# Altium schematic sheet Power.SchDoc
size A3; DocumentNumber: 3; SheetNumber: 4; SheetTotal: 11
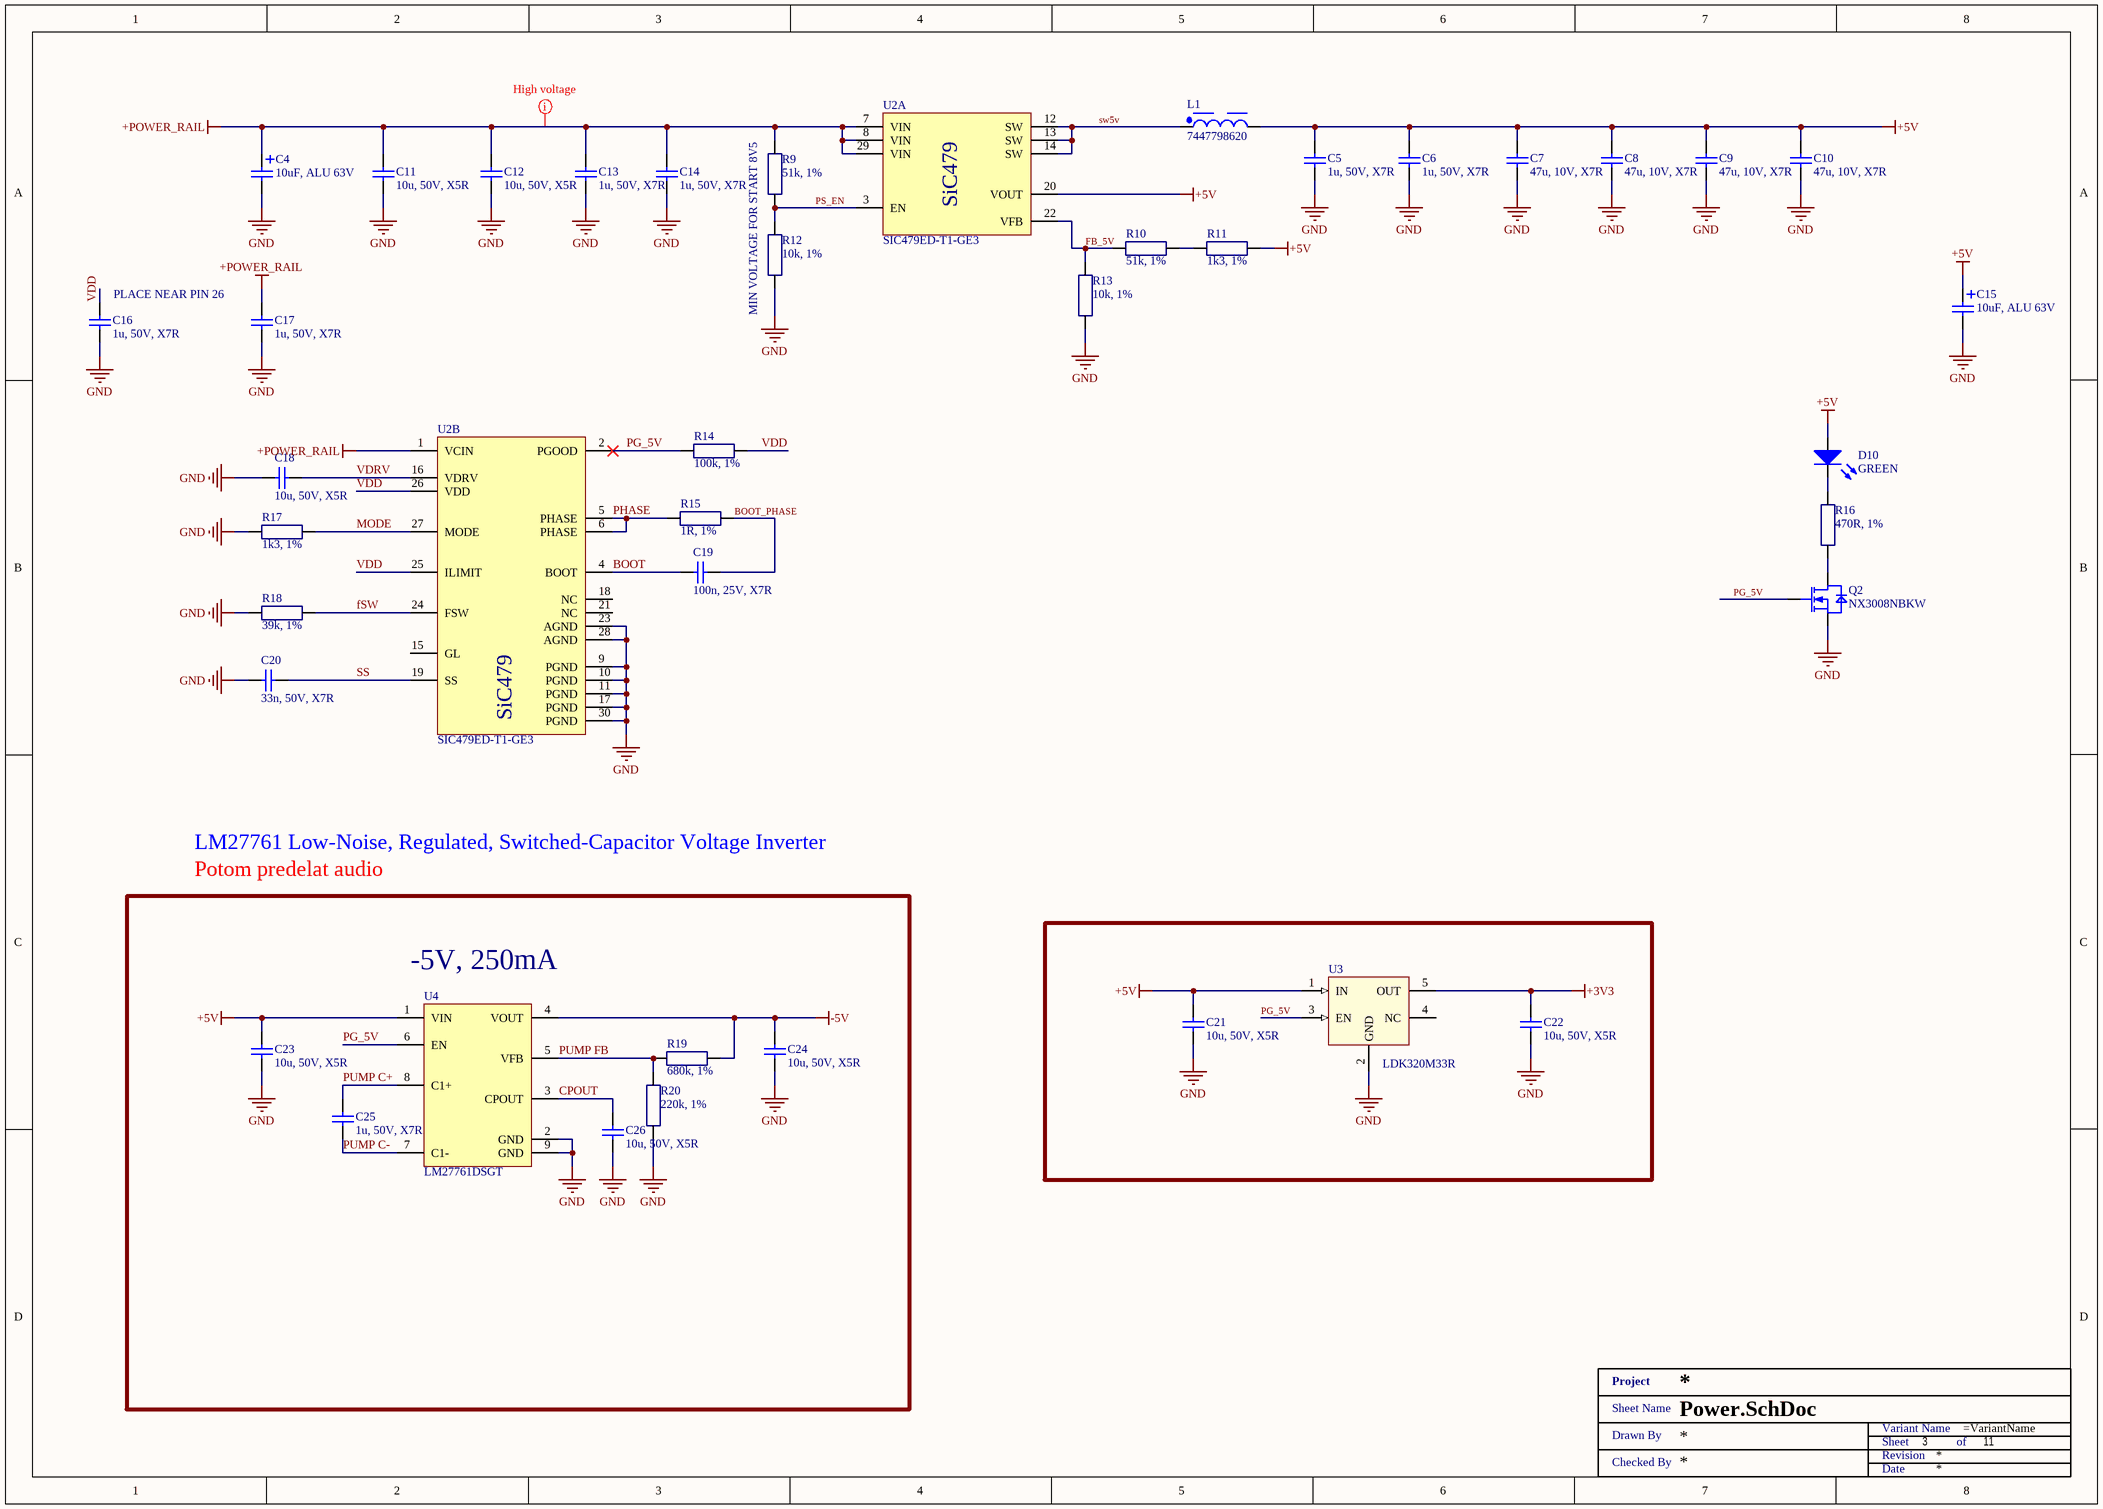
[diagram p0: Power.SchDoc]

## Parts
C4  10uF, ALU 63V  [WCAP-ATLI_5x11x2]
C5  1u, 50V, X7R  [SMD0603]
C6  1u, 50V, X7R  [SMD0603]
C7  47u, 10V, X7R  [SMD1210]
C8  47u, 10V, X7R  [SMD1210]
C9  47u, 10V, X7R  [SMD1210]
C10  47u, 10V, X7R  [SMD1210]
C11  10u, 50V, X5R  [SMD1206]
C12  10u, 50V, X5R  [SMD1206]
C13  1u, 50V, X7R  [SMD0603]
C14  1u, 50V, X7R  [SMD0603]
C15  10uF, ALU 63V  [WCAP-ATLI_5x11x2]
C16  1u, 50V, X7R  [SMD0603]
C17  1u, 50V, X7R  [SMD0603]
C18  10u, 50V, X5R  [SMD1206]
C19  100n, 25V, X7R  [SMD0603]
C20  33n, 50V, X7R  [SMD0603]
C21  10u, 50V, X5R  [SMD1206]
C22  10u, 50V, X5R  [SMD1206]
C23  10u, 50V, X5R  [SMD1206]
C24  10u, 50V, X5R  [SMD1206]
C25  1u, 50V, X7R  [SMD0603]
C26  10u, 50V, X5R  [SMD1206]
D10  GREEN  [MCL-S270]
L1  7447798620  [WE-PDF_1064]
Q2  NX3008NBKW  [SOT323]
R9  51k, 1%  [SMD0603 - R]
R10  51k, 1%  [SMD0603 - R]
R11  1k3, 1%  [SMD0603 - R]
R12  10k, 1%  [SMD0603 - R]
R13  10k, 1%  [SMD0603 - R]
R14  100k, 1%  [SMD0603 - R]
R15  1R, 1%  [SMD0603 - R]
R16  470R, 1%  [SMD0603 - R]
R17  1k3, 1%  [SMD0603 - R]
R18  39k, 1%  [SMD0603 - R]
R19  680k, 1%  [SMD0603 - R]
R20  220k, 1%  [SMD0603 - R]
U2  SIC479ED-T1-GE3  [POWERPAK_MLP55-27L_VIS]  (parts A,B of 2)
U3  LDK320M33R  [SOT23-5]
U4  LM27761DSGT  [DFN08 - 2x2mm - os]
XX?  Title 1  (value not drawn)  (graphical)

## Blocks framed on the sheet
-5V, 250mA: C23-C26 R19 R20 U4

## Nets
+3V3: C22.2 U3.5(OUT)
+5V: C5.2 C6.2 C7.2 C8.2 C9.2 C10.2 C15.1 C21.2 C23.2 D10.1(A) L1.2 R11.2 U2.20(VOUT) U3.1(IN) U4.1(VIN)
+POWER_RAIL: C4.1 C11.2 C12.2 C13.2 C14.2 C17.2 R9.2 U2.1(VCIN) U2.7(VIN) U2.8(VIN) U2.29(VIN)
-5V: C24.2 R19.2 U4.4(VOUT)
GND: C4.2 C5.1 C6.1 C7.1 C8.1 C9.1 C10.1 C11.1 C12.1 C13.1 C14.1 C15.2 C16.1 C17.1 C18.2 C20.1 C21.1 C22.1 C23.1 C24.1 C26.1 Q2.2(S) R12.1 R13.1 R17.1 R18.1 R20.1 U2.9(PGND) U2.10(PGND) U2.11(PGND) U2.17(PGND) U2.23(AGND) U2.28(AGND) U2.30(PGND) U3.2(GND) U4.2(GND) U4.9(GND)
BOOT: C19.1 U2.4(BOOT)
BOOT_PHASE: C19.2 R15.2
CPOUT: C26.2 U4.3(CPOUT)
FB_5V: R10.1 R13.2 U2.22(VFB)
fSW: R18.2 U2.24(FSW)
MODE: R17.2 U2.27(MODE)
PG_5V: Q2.1(G) R14.1 U2.2(PGOOD) U3.3(EN) U4.6(EN)
PHASE: R15.1 U2.5(PHASE) U2.6(PHASE)
PS_EN: R9.1 R12.2 U2.3(EN)
PUMP C+: C25.2 U4.8(C1+)
PUMP C-: C25.1 U4.7(C1-)
PUMP FB: R19.1 R20.2 U4.5(VFB)
SS: C20.2 U2.19(SS)
sw5v: L1.1 U2.12(SW) U2.13(SW) U2.14(SW)
VDD: C16.2 R14.2 U2.25(ILIMIT) U2.26(VDD)
VDRV: C18.1 U2.16(VDRV)
NetD10_2: D10.2(K) R16.2
NetQ2_3: Q2.3(D) R16.1
NetR10_2: R10.2 R11.1

Not connected (* = marked no-connect by the designer): U2 15(GL) 18(NC) 21(NC); U3 4(NC)

## Layout directives
net class HV: +POWER_RAIL

## Notes on the sheet
- (near C16) PLACE NEAR PIN 26
- MIN VOLTAGE FOR START 8V5
- LM27761 Low-Noise, Regulated, Switched-Capacitor Voltage Inverter
- Potom predelat audio
- (in symbol SIC479ED-T1-GE3, part A) SiC479
- (in symbol SIC479ED-T1-GE3, part B) SiC479
- (in symbol Title 1) Project; Sheet Name; Variant Name; Drawn By; Sheet; of; Revision; Checked By; Date

## Library data of the parts
C4 C15 = 860080772001: WURTH ELEKTRONIK - 860080772001 - CAP, ALU ELEC, 10UF, 63V, RADIAL; Ripple Current: 135mA @ 100kHz; Capacitance: 10u; Manufacturer: WURTH ELEKTRONIK; Manufacturer Part Number: 860080772001; RoHS: YES; Stock 1: 553; Pricing 1: 1=0.0957, 3=0.091, 5=0.0863, 10=0.0825, 20=0.0786, 50=0.0692, 250=0.0647, 500=0.0564 (GBP); ComponentLink1URL: http://www.farnell.com/datasheets/1879798.pdf; ComponentLink1Description: http://www.farnell.com/datasheets/1879798.pdf; Voltage Rating: 63V; Stock 3: 2136; Pricing 3: 1=0.62, 50=0.335, 100=0.289, 250=0.259, 500=0.235, 1500=0.202, 7500=0.182, 15000=0.178 (GBP); ComponentLink2URL: http://www.farnell.com/datasheets/2065186.pdf; ComponentLink2Description: http://www.farnell.com/datasheets/2065186.pdf; Supplier 1: Mouser; Supplier Part Number 1: 710-860080772001; Supplier 2: Farnell; Supplier Part Number 2: 2465955; Supplier 3: Digi-Key; Supplier Part Number 3: 732-9121-1-ND
C5 C6 C13 C14 C16 C17 C25 = UMK107AB7105KA-T: 0603 1 uF 50 V ±10% Tolerance X7R SMT Multilayer Ceramic Capacitor; Manufacturer: Taiyo Yuden; Supplier 1: Mouser; Supplier Part Number 1: 963-UMK107AB7105KA-T; Manufacturer Part Number: UMK107AB7105KA-T; RoHS: Yes; Category: Ceramic Capacitors; Stock 1: 419967; Pricing 1: 1=0,39000, 10=0,13500, 100=0,09200, 500=0,07800, 1000=0,06100, 4000=0,06100 (USD); Mount: Surface Mount; Case/Package: 0603; Case Code (Metric): 1608; Case Code (Imperial): 0603; Min Operating Temperature: -55°C; Max Operating Temperature: 125°C; Tolerance: 10%; Capacitance: 1u; Packaging: Tape and Reel; Package Quantity: 1; Voltage Rating: 50V; Voltage Rating (DC): 50V; Dielectric: X7R; Termination: SMD/SMT; Length: 1.6mm; Height: 0.8mm; Width: 0.031inch; Thickness: 0.037inch; Depth: 0.8mm; Radiation Hardening: No; Halogen Free: Halogen Free; ComponentLink1URL: https://datasheet.ciiva.com/15922/umk107ab7105ka-t-pdf-15922601.pdf?src-supplier=Onlinecomponents.com; ComponentLink1Description: https://datasheet.ciiva.com/15922/umk107ab7105ka-t-pdf-15922601.pdf?src-supplier=Onlinecomponents.com; ComponentLink2URL: https://datasheet.ciiva.com/6257/umk107ab7105ka-t-ss-6257600.pdf?src-supplier=Digi-Key; ComponentLink2Description: https://datasheet.ciiva.com/6257/umk107ab7105ka-t-ss-6257600.pdf?src-supplier=Digi-Key; ComponentLink3URL: https://datasheet.ciiva.com/30137/76umk107ab7105ka-t-30137806.pdf?src-supplier=Onlinecomponents.com; ComponentLink3Description: https://datasheet.ciiva.com/30137/76umk107ab7105ka-t-30137806.pdf?src-supplier=Onlinecomponents.com; Supplier 2: Farnell; Supplier Part Number 2: 2779113; Supplier 3: Digi-Key; Supplier Part Number 3: 587-3247-6-ND
C7-C10 = CL32B476MPJNNNE: Cap Ceramic 47uF 10V X7R 20% Pad SMD 1210 125C T/R; Manufacturer: Samsung; Supplier 1: Mouser; Supplier Part Number 1: 187-CL32B476MPJNNNE; Manufacturer Part Number: CL32B476MPJNNNE; RoHS: Yes; Category: Ceramic Capacitors; Stock 1: 61232; Pricing 1: 1=0.51, 10=0.377, 50=0.377, 100=0.263, 1000=0.198, 10000=0.163 (USD); Case/Package: 1210; Dielectric: X7R; Voltage Rating (DC): 10V; Tolerance: 20%; Value: 47uF; RoHS Compliant: Yes; ComponentLink1URL: http://www.samsungsem.com/kr/support/library/product-catalog/__icsFiles/afieldfile/2014/11/13/MLCC.pdf?src-supplier=Avnet; ComponentLink1Description: http://www.samsungsem.com/kr/support/library/product-catalog/__icsFiles/afieldfile/2014/11/13/MLCC.pdf?src-supplier=Avnet; Supplier 2: Arrow Electronics; Supplier Part Number 2: CL32B476MPJNNNE
C11 C12 C18 C21-C24 C26 = UMK316BBJ106KL-T: CAP CER 10UF 50V X5R 1206; Manufacturer: Taiyo Yuden; Tolerance: 10%; Supplier 1: Mouser; Supplier Part Number 1: 963-UMK316BBJ106KL-T; Manufacturer Part Number: UMK316BBJ106KL-T; RoHS: Yes; Category: Ceramic Capacitors; Stock 1: 207945; Pricing 1: 1=0,42000, 10=0,18000, 100=0,12800, 500=0,11000, 1000=0,09700, 2000=0,08000 (USD); Mount: Surface Mount; Case/Package: 1206; Min Operating Temperature: -55°C; Max Operating Temperature: 85°C; Packaging: Tape and Reel; Capacitance: 10u; Voltage Rating: 50V; Length: 0.126inch; Width: 0.063inch; Thickness: 0.071inch; Lead Free: Lead Free; ComponentLink1URL: http://ds.yuden.co.jp/TYCOMPAS/ut/detail.do?productNo=UMK316BBJ106KL-T&fileName=UMK316BBJ106KL-T_SS&mode=specSheetDownload&src-supplier=Digi-Key; ComponentLink1Description: http://ds.yuden.co.jp/TYCOMPAS/ut/detail.do?productNo=UMK316BBJ106KL-T&fileName=UMK316BBJ106KL-T_SS&mode=specSheetDownload&src-supplier=Digi-Key; ComponentLink2URL: https://www.yuden.co.jp/productdata/catalog/mlcc01_e.pdf?src-supplier=Digi-Key; ComponentLink2Description: https://www.yuden.co.jp/productdata/catalog/mlcc01_e.pdf?src-supplier=Digi-Key; ComponentLink3URL: http://www.yuden.co.jp/productdata/catalog/en/mlcc_all_e.pdf?src-supplier=Digi-Key; ComponentLink3Description: http://www.yuden.co.jp/productdata/catalog/en/mlcc_all_e.pdf?src-supplier=Digi-Key; Supplier 2: Digi-Key; Supplier Part Number 2: 587-5960-1-ND; Supplier 3: Avnet; Supplier Part Number 3: UMK316BBJ106KL-T
C19 = 06033C104KAT2A: AVX - 06033C104KAT2A - CAP, MLCC, X7R, 0.1UF, 25V, 0603; Ceramic Capacitor Case: 0603 [1608 Metric]; Voltage Rating: 25; Capacitance Tolerance: ± 10%; Dielectric Characteristic: X7; Product Range: AVX 0603 MLCC; SVHC: No SVHC (17-Dec-2015)<!--FANDB--><div class="features-and-benefits-container"><div class="features-and-benefits-desc-container"><span class="features-and-benefits-container-desc">SMD Multilayer Ceramic Capacitor, 0603 [1608 Metric], 0.1 µF, 25 V, ± 10%, X7R, AVX 0603 MLCC</span></div><div class="features-and-benefits-description"><span class="features-benefits-value">The 06033C104KAT2A is a SMD Multilayer Ceramic Capacitor with Ni/Sn-plated termination, X7R dielectric and 0603 case. X7R formulations are called temperature stable ceramics and fall into EIA class II materials. X7R is the most popular of this intermediate dielectric constant material. This capacitance change is non-linear. Capacitance for X7R varies under the influence of electrical operating conditions such as voltage and frequency. X7; Supplier 1: Farnell; Supplier Part Number 1: 2530141; Manufacturer: AVX; Manufacturer Part Number: 06033C104KAT2A; RoHS: YES; Stock 1: 22809; Pricing 1: 10=0.012, 100=0.0096, 500=0.0069, 1000=0.006, 2000=0.0048, 4000=0.0038, 20000=0.0027, 40000=0.0026 (GBP); Capacitance: 100n; Packaging: Cut Tape; Operating Temperature Min: -55; Operating Temperature Max: 125; Automotive Qualification Standard: -; MSL: MSL 1 - Unlimited; ComponentLink1URL: http://www.farnell.com/datasheets/2237835.pdf; ComponentLink1Description: http://www.farnell.com/datasheets/2237835.pdf; Supplier 2: Digi-Key; Supplier Part Number 2: 478-3714-1-ND
C20 = 06035C333JAT2A: 0603 33nF Ceramic Multilayer Capacitor; 50 V dc; +125degC; X7R Dielectric; +/-5%; Manufacturer: Kyocera AVX; Tolerance: 5%; Dissipation Factor: 2.5%; Supplier 1: Mouser; Supplier Part Number 1: 581-06035C333J; Manufacturer Part Number: 06035C333JAT2A; Stock 1: 266948; Pricing 1: 1 = 0.13000, 10 = 0.12100, 50 = 0.12100, 100 = 0.06000, 1000 = 0.03600, 10000 = 0.02400 (USD); RoHS: Yes; Mount: Surface Mount,PCB; Case/Package: 0603; Number of Pins: 2; Case Code (Metric): 1608; Case Code (Imperial): 0603; Contact Plating: Tin,Matte; Dielectric Material: Ceramic; Min Operating Temperature: -55°C; Max Operating Temperature: 125°C; Capacitance: 33n; Dielectric: X7R; Packaging: Tape and Reel; Voltage Rating (DC): 50V; Package Quantity: 1; Voltage Rating: 50V; Termination: SMD/SMT; Voltage: 50V; Length: 1.6mm; Height: 0.9mm; Width: 0.032inch; Depth: 0.81mm; Thickness: 0.035inch; Radiation Hardening: No; REACH SVHC: No SVHC; Lead Free: Lead Free; ComponentLink1URL: https://datasheet.ciiva.com/7855/1679506-7855093.pdf?src-supplier=Element14; ComponentLink1Description: https://datasheet.ciiva.com/7855/1679506-7855093.pdf?src-supplier=Element14; ComponentLink2URL: https://datasheet.ciiva.com/28694/cx7r-28694479.pdf?src-supplier=Element14; ComponentLink2Description: https://datasheet.ciiva.com/28694/cx7r-28694479.pdf?src-supplier=Element14; ComponentLink3URL: https://datasheet.ciiva.com/152/cx7r-152032.pdf?src-supplier=Digi-Key; ComponentLink3Description: https://datasheet.ciiva.com/152/cx7r-152032.pdf?src-supplier=Digi-Key; ComponentLink4URL: https://datasheet.ciiva.com/152/cx7r-152033.pdf?src-supplier=Digi-Key; ComponentLink4Description: https://datasheet.ciiva.com/152/cx7r-152033.pdf?src-supplier=Digi-Key; ComponentLink5URL: https://datasheet.ciiva.com/1457/84526-1457941.pdf?src-supplier=Element14; ComponentLink5Description: https://datasheet.ciiva.com/1457/84526-1457941.pdf?src-supplier=Element14; ComponentLink6URL: https://datasheet.ciiva.com/1457/84526-1457942.pdf?src-supplier=Element14; ComponentLink6Description: https://datasheet.ciiva.com/1457/84526-1457942.pdf?src-supplier=Element14; ComponentLink7URL: https://datasheet.ciiva.com/17084/cx7r-17084518.pdf?src-supplier=Future+Electronics; ComponentLink7Description: https://datasheet.ciiva.com/17084/cx7r-17084518.pdf?src-supplier=Future+Electronics; ComponentLink8URL: https://datasheet.ciiva.com/2987/cx7r-2987848.pdf?src-supplier=Avnet; ComponentLink8Description: https://datasheet.ciiva.com/2987/cx7r-2987848.pdf?src-supplier=Avnet; ComponentLink9URL: https://datasheet.ciiva.com/14605/70001075-14605242.pdf?src-supplier=Allied+Electronics; ComponentLink9Description: https://datasheet.ciiva.com/14605/70001075-14605242.pdf?src-supplier=Allied+Electronics; ComponentLink10URL: https://datasheet.ciiva.com/152/cx7r-152031.pdf?src-supplier=Digi-Key; ComponentLink10Description: https://datasheet.ciiva.com/152/cx7r-152031.pdf?src-supplier=Digi-Key; Supplier 2: Farnell; Supplier Part Number 2: 2280893; Supplier 3: Digi-Key; Supplier Part Number 3: 478-3723-1-ND; Supplier 4: Arrow; Supplier Part Number 4: 06035C333JAT2A
D10 = MCL-S270GC: MULTICOMP - MCL-S270GC - LED, 0805, GREEN, 10MCD, 570NM; LED Mounting: SMD; Bulb Size: 1.25mm x 1.4; Forward Current If: 20; Forward Voltage: 2.1; Wavelength Typ: 570; Luminous Intensity: 10; Viewing Angle: 140°; Lens Shape: Rectangular; SVHC: No SVHC (17-Dec-2015); Forward Voltage VF Max: 2.6; LED / Lamp Size: 1.4mm x 1.25; LED Type: Standard; Luminous Intensity Max: 16; Luminous Intensity Min: 4.5; No. of Pins: 2; Peak Forward Current: 100; Peak Wavelength: 568; Reverse Protection Voltage: 5; Voltage Vf Min: 1.7; Voltage Vf Typ: 2.1V<!--FANDB--><div class="features-and-benefits-container"><div class="features-and-benefits-description"><span class="features-benefits-value">The MCL-S270GC is a green SMD LED made of GaP dice. This LED offers water clear rectangular lens and 260°C for 5 seconds lead soldering temperature range 1.6mm from body.</span></div><div class="features-and-benefits-list"><ul class="features-and-benefits-list-list"><li class="features-and-benefits-list-item">-40 to 85; Manufacturer: MULTICOMP; Manufacturer Part Number: MCL-S270GC; RoHS: YES; Stock 1: 80989; Pricing 1: 5=0,145, 25=0,136, 100=0,126, 250=0,0813, 500=0,0645, 2000=0,0559, 5000=0,0496, 20000=0,0434 (GBP); LED Colour: Green; Packaging: Cut Tape; Product Range: -; Automotive Qualification Standard: -; MSL: MSL 3 - 168 hours; Current Rating: 20; Dominant Wavelength: 570; Dominant Wavelength Typ: 570; Forward Current If Max: 20; Luminous Intensity Typ: 10; Operating Temperature Max: 85; Operating Temperature Min: -40; Operating Temperature Range: -40°C to +85; Storage Temperature Max: +100; Storage Temperature Min: -40; ComponentLink1URL: http://www.farnell.com/cad/53028.pdf; ComponentLink1Description: http://www.farnell.com/cad/53028.pdf; ComponentLink2URL: http://www.farnell.com/datasheets/1671537.pdf; ComponentLink2Description: http://www.farnell.com/datasheets/1671537.pdf; Supplier 1: Farnell; Supplier Part Number 1: 1581242; Supplier 2: Newark; Supplier Part Number 2: 14N9356
L1 = CMP-0227-00046-2: NexarPartId: 14415868; Tolerance: 30%; RMS Current (Irms): 9.4A; Shielding: Shielded; DC Resistance (DCR): 8.4mΩ; Self Resonant Frequency: 33MHz; Max DC Current: 7A; Test Frequency: 100kHz; Core Material: Composite, Ferrite, Metal; Inductance: 6.2µH; Saturation Current: 6.7A; Number of Pins: 2; Depth: 10.2mm; Length: 10.2mm; Termination: SMD/SMT; Ambient Temperature Range High: 110°C; Max Operating Temperature: 150°C; Mount: Surface Mount; Lead Pitch: 5.8mm; Inductance Tolerance: 30%; REACH SVHC: No SVHC; Width: 10.2mm; Min Operating Temperature: -40°C; Case/Package: 1064; Height - Seated (Max): 6.4008mm; RoHS: Compliant; Current Rating: 9.4A; Ambient Temperature Range Low: -40°C; Height: 6.1mm; Composition: Wirewound; Packaging: Tape & Reel (TR)
Q2 = NX3008NBKW: NXP - NX3008NBKW - MOSFET, N CH, 30V, 350MA, SOT323; Transistor Polarity: N Channel; Continuous Drain Current Id: 350; Drain Source Voltage Vds: 30; On Resistance Rds(on): 1; Rds(on) Test Voltage Vgs: 4.5; Threshold Voltage Vgs: 900; Power Dissipation Pd: 260; Transistor Case Style: SOT-323; No. of Pins: 3; SVHC: No SVHC (17-Dec-2015); Pulse Current Idm: -0.8; Voltage Vgs th Max: 8; Manufacturer: NXP; Manufacturer Part Number: NX3008NBKW; RoHS: YES; Stock 1: 4764; Pricing 1: 1=0.0425, 25=0.0385, 100=0.0347, 250=0.0334, 500=0.0312, 2000=0.0291, 4000=0.0282, 20000=0.0273 (GBP); Operating Temperature Max: 150; Product Range: -; Automotive Qualification Standard: -; MSL: MSL 1 - Unlimited; Operating Temperature Min: -55; Operating Temperature Range: -55°C to +150; ComponentLink1URL: http://www.farnell.com/datasheets/1508392.pdf; ComponentLink1Description: http://www.farnell.com/datasheets/1508392.pdf; Supplier 1: Mouser; Supplier Part Number 1: 771-NX3008NBKW,115; Supplier 2: Farnell; Supplier Part Number 2: 2069546; Supplier 3: Arrow; Supplier Part Number 3: NX3008NBKW,115
R9 R10 = RC0603FR-0751KL: RES SMD 51K OHM 1% 1/10W 0603; Manufacturer: Yageo; Power Rating: 100mW; Voltage Rating: 50V; Temperature Coefficient: 100ppm/°C; Supplier 1: Mouser; Supplier Part Number 1: 603-RC0603FR-0751KL; Manufacturer Part Number: RC0603FR-0751KL; RoHS: Yes; Category: Chip SMD Resistors; Stock 1: 522902; Pricing 1: 1=0,10000, 10=0,01800, 50=0,01800, 100=0,00600, 1000=0,00500, 10000=0,00300 (USD); Case/Package: 0603; Number of Pins: 2; Case Code (Imperial): 0603; Case Code (Metric): 1608; Size Code: 0603; Min Operating Temperature: -55°C; Max Operating Temperature: 155°C; Tolerance: 1%; Resistance: 51k; Packaging: Tape and Reel; Package Quantity: 1; Termination: SMD/SMT; Resistor Type: Thick Film; Number of Terminations: 2; Max Power Dissipation: 100mW; Voltage Rating (DC): 50V; Features: Moisture Resistant; Series: RC; Resistance Tolerance: 1%; Technology: THICK FILM; Length: 1.6mm; Width: 0.8mm; Height: 0.45mm; Depth: 0.8mm; REACH SVHC: No SVHC; Lead Free: Lead Free; RoHS Compliant: Yes; ComponentLink1URL: https://datasheet.ciiva.com/11819/0900766b80f96399-11819378.pdf?src-supplier=RSComponents; ComponentLink1Description: https://datasheet.ciiva.com/11819/0900766b80f96399-11819378.pdf?src-supplier=RSComponents; ComponentLink2URL: https://datasheet.ciiva.com/46395/443971-46395014.pdf?src-supplier=Element14; ComponentLink2Description: https://datasheet.ciiva.com/46395/443971-46395014.pdf?src-supplier=Element14; ComponentLink3URL: https://datasheet.ciiva.com/12558/rc0603-272842-12558554.pdf?src-supplier=Mouser; ComponentLink3Description: https://datasheet.ciiva.com/12558/rc0603-272842-12558554.pdf?src-supplier=Mouser; ComponentLink4URL: https://datasheet.ciiva.com/2454/pyu-r-int-thick-7-2454123.pdf?src-supplier=Digi-Key; ComponentLink4Description: https://datasheet.ciiva.com/2454/pyu-r-int-thick-7-2454123.pdf?src-supplier=Digi-Key; ComponentLink5URL: https://datasheet.ciiva.com/2454/pyu-r-int-thick-7-2454124.pdf?src-supplier=Digi-Key; ComponentLink5Description: https://datasheet.ciiva.com/2454/pyu-r-int-thick-7-2454124.pdf?src-supplier=Digi-Key; ComponentLink6URL: https://datasheet.ciiva.com/2454/pyu-r-int-thick-7-2454125.pdf?src-supplier=Digi-Key; ComponentLink6Description: https://datasheet.ciiva.com/2454/pyu-r-int-thick-7-2454125.pdf?src-supplier=Digi-Key; Supplier 2: Farnell; Supplier Part Number 2: 3495872; Supplier 3: Digi-Key; Supplier Part Number 3: 311-51.0KHRCT-ND
R11 R17 = RC0603FR-071K3L: RES SMD 1.3K OHM 1% 1/10W 0603; Manufacturer: Yageo; Power Rating: 100mW; Voltage Rating: 50V; Temperature Coefficient: 100ppm/°C; Working Voltage: 75V; Supplier 1: Mouser; Supplier Part Number 1: 603-RC0603FR-071K3L; Manufacturer Part Number: RC0603FR-071K3L; RoHS: Yes; Category: Chip SMD Resistors; Stock 1: 82418; Pricing 1: 1=0,10000, 10=0,01800, 50=0,01800, 100=0,00600, 1000=0,00500, 10000=0,00300 (USD); Case/Package: 0603; Case Code (Imperial): 0603; Case Code (Metric): 1608; Min Operating Temperature: -55°C; Max Operating Temperature: 155°C; Resistance: 1k3; Tolerance: 1%; Packaging: Tape and Reel; Termination: SMD/SMT; Resistor Type: Thick Film; Voltage Rating (DC): 50V; Number of Terminations: 2; Features: Moisture Resistant; Series: RC; Max Power Dissipation: 100mW; Construction: Rectangular; Technology: THICK FILM; Length: 1.6mm; Width: 800um; Depth: 0.8mm; Military Standard: Not; Lead Free: Lead Free; RoHS Compliant: Yes; ComponentLink1URL: http://www.mouser.com/ds/2/447/RC0603-272842.pdf?src-supplier=Mouser; ComponentLink1Description: http://www.mouser.com/ds/2/447/RC0603-272842.pdf?src-supplier=Mouser; ComponentLink2URL: http://components.arrow.com/part/dataview/0323_00200771?src-supplier=Arrow+Europe; ComponentLink2Description: http://components.arrow.com/part/dataview/0323_00200771?src-supplier=Arrow+Europe; ComponentLink3URL: http://www.yageo.com/documents/recent/PYu-RC_Group_51_RoHS_L_9.pdf?src-supplier=Digi-Key; ComponentLink3Description: http://www.yageo.com/documents/recent/PYu-RC_Group_51_RoHS_L_9.pdf?src-supplier=Digi-Key; ComponentLink4URL: http://www.yageo.com/documents/recent/PYu-RC_Group_51_RoHS_L_10.pdf?src-supplier=Digi-Key; ComponentLink4Description: http://www.yageo.com/documents/recent/PYu-RC_Group_51_RoHS_L_10.pdf?src-supplier=Digi-Key; ComponentLink5URL: http://www.yageo.com/documents/recent/PYu-RC0603_51_RoHS_L_v5.pdf?src-supplier=Future+Electronics; ComponentLink5Description: http://www.yageo.com/documents/recent/PYu-RC0603_51_RoHS_L_v5.pdf?src-supplier=Future+Electronics; Supplier 2: Farnell; Supplier Part Number 2: 3495755; Supplier 3: Digi-Key; Supplier Part Number 3: 311-1.30KHRCT-ND
R12 R13 = RC0603FR-0710KL: YAGEO (PHYCOMP) - RC0603FR-0710KL - RES, THICK FILM, 10K, 1%, 0.1W, 0603; Voltage Rating: 50; Resistor Case Style: 0603 [1608 Metric]; Power Rating: 100; Product Range: RC Series; Temperature Coefficient: ± 100; SVHC: No SVHC (20-Jun-2016); Manufacturer: YAGEO (PHYCOMP); Manufacturer Part Number: RC0603FR-0710KL; RoHS: YES; Stock 1: 9995; Pricing 1: 5000=0.0025, 25000=0.0014, 50000=0.0013 (GBP); Resistance: 10k; Resistance Tolerance: ± 1%; Packaging: Tape & Reel; Resistor Element Material: Thick Film; Automotive Qualification Standard: -; MSL: MSL 1 - Unlimited<!--FANDB--><div class="features-and-benefits-container"><div class="features-and-benefits-desc-container"><span class="features-and-benefits-container-desc">SMD Chip Resistor, Thick Film, 10 kohm, 50 V, 0603 [1608 Metric], 100 mW, ± 1; ComponentLink1URL: http://past.yageo.com/pdf/PYu-R_Packing_6.pdf; ComponentLink1Description: http://past.yageo.com/pdf/PYu-R_Packing_6.pdf; ComponentLink2URL: http://www.farnell.com/datasheets/2167052.pdf; ComponentLink2Description: http://www.farnell.com/datasheets/2167052.pdf; Supplier 1: Mouser; Supplier Part Number 1: 603-RC0603FR-0710KL; Supplier 2: Farnell; Supplier Part Number 2: 2421850; Supplier 3: Digi-Key; Supplier Part Number 3: 311-10.0KHRCT-ND
R14 = RC0603FR-07100KL: RES SMD 100K OHM 1% 1/10W 0603; Manufacturer: Yageo; Power (Watts): 0.1W, 1/10W; Temperature Coefficient: ±100ppm/°C; Manufacturer Part Number: RC0603FR-07100KL; RoHS: RoHS Compliant; Category: Resistors; Stock 1: 14618646; Pricing 1: 1=0.1, 10=0.015, 100=0.006, 1000=0.00268, 2500=0.00233 (USD); Packaging: Cut Tape (CT); Part Status: Active; Tolerance: ±1%; Composition: Thick Film; Features: Moisture Resistant; Operating Temperature: -55°C ~ 155°C; Package / Case: 0603 (1608 Metric); Supplier Device Package: 0603; Size / Dimension: 0.063" L x 0.032" W (1.60mm x 0.80mm); Height - Seated (Max): 0.022" (0.55mm); Failure Rate: -; ComponentLink1URL: http://www.yageo.com/documents/recent/PYu-RC_Group_51_RoHS_L_8.pdf; ComponentLink1Description: http://www.yageo.com/documents/recent/PYu-RC_Group_51_RoHS_L_8.pdf; Resistance: 100k; Supplier 1: Mouser; Supplier Part Number 1: 603-RC0603FR-07100KL; Supplier 2: Farnell; Supplier Part Number 2: 9238727; Supplier 3: Digi-Key; Supplier Part Number 3: 311-100KHRCT-ND
R15 = RC0603FR-071RL: SMD Chip Resistor, 1 Ohm, ± 1%, 100 mW, 0603 [1608 Metric], Thick Film, General Purpose; Manufacturer: Yageo; Power Rating: 100mW; Voltage Rating: 50V; Temperature Coefficient: 200ppm/°C; Supplier 1: Mouser; Supplier Part Number 1: 603-RC0603FR-071RL; Manufacturer Part Number: RC0603FR-071RL; RoHS: Yes; Category: Chip SMD Resistors; Stock 1: 1036633; Pricing 1: 1=0,1, 10=0,018, 50=0,018, 100=0,011, 1000=0,009, 10000=0,004 (USD); Case/Package: 0603; Pins: 2; Case Code (Imperial): 0603; Case Code (Metric): 1608; Min Operating Temperature: -55°C; Max Operating Temperature: 155°C; Resistance: 1R; Tolerance: 1%; Packaging: Tape and Reel; Voltage Rating (DC): 50V; Package Quantity: 1; Resistor Type: Thick Film; Termination: SMD/SMT; Number of Terminations: 2; Max Power Dissipation: 100mW; Features: Moisture Resistant; Series: RC; Technology: THICK FILM; Resistance Tolerance: 1%; Length: 0.063inch; Width: 0.031inch; Height: 0.022inch; Depth: 0.8mm; Lead Free: Lead Free; RoHS Compliant: Yes; Reach SVHC Compliant: Unknown; ComponentLink1URL: https://datasheet.ciiva.com/11808/0900766b80f96399-11808162.pdf?src-supplier=Rs; ComponentLink1Description: https://datasheet.ciiva.com/11808/0900766b80f96399-11808162.pdf?src-supplier=Rs; ComponentLink2URL: https://datasheet.ciiva.com/6547/pyu-r-int-thick-7-6547270.pdf?src-supplier=Digi-Key; ComponentLink2Description: https://datasheet.ciiva.com/6547/pyu-r-int-thick-7-6547270.pdf?src-supplier=Digi-Key; ComponentLink3URL: https://datasheet.ciiva.com/6547/pyu-r-int-thick-7-6547271.pdf?src-supplier=Digi-Key; ComponentLink3Description: https://datasheet.ciiva.com/6547/pyu-r-int-thick-7-6547271.pdf?src-supplier=Digi-Key; ComponentLink4URL: https://datasheet.ciiva.com/6547/pyu-r-int-thick-7-6547269.pdf?src-supplier=Digi-Key; ComponentLink4Description: https://datasheet.ciiva.com/6547/pyu-r-int-thick-7-6547269.pdf?src-supplier=Digi-Key; ComponentLink5URL: https://datasheet.ciiva.com/7746/1738695-7746296.pdf?src-supplier=Element14; ComponentLink5Description: https://datasheet.ciiva.com/7746/1738695-7746296.pdf?src-supplier=Element14; ComponentLink6URL: https://datasheet.ciiva.com/7746/1738695-7746297.pdf?src-supplier=Element14; ComponentLink6Description: https://datasheet.ciiva.com/7746/1738695-7746297.pdf?src-supplier=Element14; Supplier 2: Newark; Supplier Part Number 2: 75X0138; Supplier 3: Digi-Key; Supplier Part Number 3: 311-1.00HRCT-ND
R16 = RC0603FR-07470RL: YAGEO         RC0603FR-07470RL             SMD Chip Resistor, Thick Film, 470 ohm, 50 V, 0603 [1608 Metric], 100 mW,  1%, RC Series; Power Rating: 100mW; Voltage Rating: 50V; Temperature Coefficient: 100ppm/°C; Working Voltage: 75V; Supplier 1: Mouser; Supplier Part Number 1: 603-RC0603FR-07470RL; Manufacturer: Yageo; Manufacturer Part Number: RC0603FR-07470RL; RoHS: Yes; Category: Chip SMD Resistors; Stock 1: 361309; Pricing 1: 1=0,10000, 10=0,01800, 100=0,00600, 1000=0,00500, 5000=0,00300, 10000=0,00300 (USD); Case/Package: 0603; Case Code (Metric): 1608; Case Code (Imperial): 0603; Min Operating Temperature: -55°C; Max Operating Temperature: 155°C; Tolerance: 1%; Resistance: 470R; Packaging: Tape and Reel; Package Quantity: 1; Composition: Thick Film; Number of Terminations: 2; Termination: SMD/SMT; Military Standard: Not; Max Power Dissipation: 100mW; Features: Moisture Resistant; Length: 1.6mm; Height: 0.022inch; Width: 0.031inch; Depth: 0.8mm; REACH SVHC: No SVHC; Lead Free: Lead Free; ComponentLink1URL: https://datasheet.ciiva.com/11808/0900766b80f96399-11808177.pdf?src-supplier=RSComponents; ComponentLink1Description: https://datasheet.ciiva.com/11808/0900766b80f96399-11808177.pdf?src-supplier=RSComponents; ComponentLink2URL: https://datasheet.ciiva.com/7746/1738695-7746359.pdf?src-supplier=Element14; ComponentLink2Description: https://datasheet.ciiva.com/7746/1738695-7746359.pdf?src-supplier=Element14; ComponentLink3URL: https://datasheet.ciiva.com/7746/1738695-7746360.pdf?src-supplier=Element14; ComponentLink3Description: https://datasheet.ciiva.com/7746/1738695-7746360.pdf?src-supplier=Element14; ComponentLink4URL: https://datasheet.ciiva.com/7660/1868787-7660793.pdf?src-supplier=Element14; ComponentLink4Description: https://datasheet.ciiva.com/7660/1868787-7660793.pdf?src-supplier=Element14; ComponentLink5URL: https://datasheet.ciiva.com/46440/1868787-46440907.pdf?src-supplier=Element14; ComponentLink5Description: https://datasheet.ciiva.com/46440/1868787-46440907.pdf?src-supplier=Element14; ComponentLink6URL: https://datasheet.ciiva.com/2454/pyu-r-int-thick-7-2454012.pdf?src-supplier=Digi-Key; ComponentLink6Description: https://datasheet.ciiva.com/2454/pyu-r-int-thick-7-2454012.pdf?src-supplier=Digi-Key; ComponentLink7URL: https://datasheet.ciiva.com/2454/pyu-r-int-thick-7-2454013.pdf?src-supplier=Digi-Key; ComponentLink7Description: https://datasheet.ciiva.com/2454/pyu-r-int-thick-7-2454013.pdf?src-supplier=Digi-Key; ComponentLink8URL: https://datasheet.ciiva.com/2454/pyu-r-int-thick-7-2454014.pdf?src-supplier=Digi-Key; ComponentLink8Description: https://datasheet.ciiva.com/2454/pyu-r-int-thick-7-2454014.pdf?src-supplier=Digi-Key; Supplier 2: Farnell; Supplier Part Number 2: 2421875; Supplier 3: Digi-Key; Supplier Part Number 3: 311-470HRDKR-ND
R18 = RC0603FR-0739KL: RES SMD 39K OHM 1% 1/10W 0603; Manufacturer: Yageo; Temperature Coefficient: 100ppm/°C; Voltage Rating (DC): 50V; Power Rating: 100mW; Supplier 1: Mouser; Supplier Part Number 1: 603-RC0603FR-0739KL; Manufacturer Part Number: RC0603FR-0739KL; Stock 1: 607854; Pricing 1: 1 = 0.10000, 10 = 0.01800, 50 = 0.01800, 100 = 0.00600, 1000 = 0.00500, 10000 = 0.00300 (USD); RoHS: Yes; Case/Package: 0603; Number of Pins: 2; Case Code (Imperial): 0603; Case Code (Metric): 1608; Min Operating Temperature: -55°C; Max Operating Temperature: 155°C; Tolerance: 1%; Resistance: 39k; Composition: Thick Film; Packaging: Tape and Reel; Voltage Rating: 50V; Termination: SMD/SMT; Military Standard: Not; Length: 1.6mm; Height: 0.45mm; Width: 0.8mm; Depth: 0.8mm; REACH SVHC: No SVHC; Lead Free: Lead Free; ComponentLink1URL: https://datasheet.ciiva.com/11819/0900766b80f96399-11819356.pdf?src-supplier=RSComponents; ComponentLink1Description: https://datasheet.ciiva.com/11819/0900766b80f96399-11819356.pdf?src-supplier=RSComponents; ComponentLink2URL: https://datasheet.ciiva.com/7746/443971-7746341.pdf?src-supplier=Element14; ComponentLink2Description: https://datasheet.ciiva.com/7746/443971-7746341.pdf?src-supplier=Element14; Supplier 2: Arrow; Supplier Part Number 2: RC0603FR-0739KL; Supplier 3: Farnell; Supplier Part Number 3: 9238670; Supplier 4: Digi-Key; Supplier Part Number 4: 311-39.0KHRCT-ND; Supplier 5: Newark; Supplier Part Number 5: 98K7406
R19 = CRCW0603680KFKEA: RES SMD 680K OHM 1% 1/10W 0603; Manufacturer: Vishay; Temperature Coefficient: 100ppm/°C; Power Rating: 100mW; Voltage Rating: 75V; Manufacturer Part Number: CRCW0603680KFKEA; Stock: 1696; Pricing 1: 1=0.1, 10=0.044, 50=0.044, 100=0.026, 1000=0.018, 10000=0.006 (USD); Case/Package: 0603; Number of Pins: 2; Weight: 7.1E-05oz; Contact Plating: Tin; Case Code (Imperial): 0603; Case Code (Metric): 1608; Min Operating Temperature: -55°C; Max Operating Temperature: 155°C; Composition: Thick Film; Tolerance: 1%; Resistance: 680k; Packaging: Tape and Reel; Package Quantity: 10; Number of Terminations: 2; Termination: SMD/SMT; Max Power Dissipation: 100mW; Military Standard: Not; Voltage Rating (DC): 75V; Length: 1.55mm; Height: 0.45mm; Width: 0.85mm; Depth: 0.85mm; Radiation Hardening: No; Lead Free: Lead Free; REACH SVHC: Unknown; ComponentLink1URL: https://datasheet.ciiva.com/11809/0900766b80d98afc-11809140.pdf; ComponentLink1Description: https://datasheet.ciiva.com/11809/0900766b80d98afc-11809140.pdf; ComponentLink2URL: https://datasheet.ciiva.com/7673/1697337-7673317.pdf; ComponentLink2Description: https://datasheet.ciiva.com/7673/1697337-7673317.pdf; ComponentLink3URL: https://datasheet.ciiva.com/5543/dcrcwe3-109170-5543895.pdf; ComponentLink3Description: https://datasheet.ciiva.com/5543/dcrcwe3-109170-5543895.pdf; ComponentLink4URL: https://datasheet.ciiva.com/22708/1697337-22708425.pdf; ComponentLink4Description: https://datasheet.ciiva.com/22708/1697337-22708425.pdf; ComponentLink5URL: https://datasheet.ciiva.com/2513/dcrcwe3-2513674.pdf; ComponentLink5Description: https://datasheet.ciiva.com/2513/dcrcwe3-2513674.pdf; ComponentLink6URL: https://datasheet.ciiva.com/2513/dcrcwe3-2513675.pdf; ComponentLink6Description: https://datasheet.ciiva.com/2513/dcrcwe3-2513675.pdf; ComponentLink7URL: https://datasheet.ciiva.com/2513/dcrcwe3-2513676.pdf; ComponentLink7Description: https://datasheet.ciiva.com/2513/dcrcwe3-2513676.pdf; ComponentLink8URL: https://datasheet.ciiva.com/8924/dcrcwe3-8924030.pdf; ComponentLink8Description: https://datasheet.ciiva.com/8924/dcrcwe3-8924030.pdf; ComponentLink9URL: https://datasheet.ciiva.com/16768/70201119-16768654.pdf; ComponentLink9Description: https://datasheet.ciiva.com/16768/70201119-16768654.pdf; Supplier 1: Mouser; Supplier Part Number 1: 71-CRCW0603-680K-E3; Supplier 2: Farnell; Supplier Part Number 2: 2138587RL; Supplier 3: RSComponents; Supplier Part Number 3: 6790623; Supplier 4: Arrow Europe; Supplier Part Number 4: CRCW0603680KFKEA; Supplier 5: Digi-Key; Supplier Part Number 5: 541-680KHDKR-ND
R20 = RC0603FR-07220KL: RES SMD 220K OHM 1% 1/10W 0603; Manufacturer: Yageo; Power (Watts): 0.1W, 1/10W; Temperature Coefficient: ±100ppm/°C; Manufacturer Part Number: RC0603FR-07220KL; RoHS: RoHS Compliant; Category: Resistors; Stock 1: 1289984; Pricing 1: 1=0.1, 10=0.015, 100=0.006, 1000=0.00268, 2500=0.00233 (USD); Packaging: Cut Tape (CT); Part Status: Active; Tolerance: ±1%; Composition: Thick Film; Features: Moisture Resistant; Operating Temperature: -55°C ~ 155°C; Package / Case: 0603 (1608 Metric); Supplier Device Package: 0603; Size / Dimension: 0.063" L x 0.032" W (1.60mm x 0.80mm); Height - Seated (Max): 0.022" (0.55mm); Failure Rate: -; ComponentLink1URL: http://www.yageo.com/documents/recent/PYu-RC_Group_51_RoHS_L_8.pdf; ComponentLink1Description: http://www.yageo.com/documents/recent/PYu-RC_Group_51_RoHS_L_8.pdf; Resistance: 220k; Supplier 1: Mouser; Supplier Part Number 1: 603-RC0603FR-07220KL; Supplier 2: Digi-Key; Supplier Part Number 2: 311-220KHRCT-ND
U2 = SIC479ED-T1-GE3: Switching Voltage Regulators microBUCK 4.5-55V; 3A; Manufacturer: Vishay; Supplier 1: Mouser; Supplier Part Number 1: 78-SIC479ED-T1-GE3; Manufacturer Part Number: SIC479ED-T1-GE3; RoHS: Yes; Category: Voltage Regulators - Switching; Stock 1: 3358; Pricing 1: 1=4.1, 10=3.69, 50=3.41, 100=3.02, 1000=2.41, 10000=2.4 (USD); ComponentLink1URL: http://www.vishay.com/docs/77113/sic47x.pdf?src-supplier=Digi-Key; ComponentLink1Description: http://www.vishay.com/docs/77113/sic47x.pdf?src-supplier=Digi-Key; ComponentLink2URL: https://datasheet.octopart.com/SIC479ED-T1-GE3-Vishay-datasheet-156007660.pdf?src-supplier=Future+Electronics; ComponentLink2Description: https://datasheet.octopart.com/SIC479ED-T1-GE3-Vishay-datasheet-156007660.pdf?src-supplier=Future+Electronics; Supplier 2: Digi-Key; Supplier Part Number 2: 742-SIC479ED-T1-GE3CT-ND; Supplier 3: Newark; Supplier Part Number 3: 23AH3586; Supplier 4: Farnell; Supplier Part Number 4: 3212621
U3 = LDK320M33R: IC REG LINEAR 200MA SOT23-5; Manufacturer: STMicroelectronics; Output Configuration: Positive; Output Type: Fixed; Voltage - Input (Max): 18V; Voltage - Output (Min/Fixed): 3.3V; Voltage Dropout (Max): 0.35V @ 200mA; PSRR: 88dB (120Hz); Control Features: Enable; Protection Features: Over Current, Over Temperature; Manufacturer Part Number: LDK320M33R; RoHS: RoHS Compliant; Category: Integrated Circuits (ICs); Stock 1: 5592; Pricing 1: 1=0.85, 10=0.748, 100=0.5733, 500=0.4532, 1000=0.36256 (USD); Packaging: Cut Tape (CT); Part Status: Active; Current - Output: 200mA; Operating Temperature: -40°C ~ 125°C (TJ); Mounting Type: Surface Mount; Package / Case: SC-74A, SOT-753; Supplier Device Package: SOT-23-5; ComponentLink1URL: http://www.st.com/content/ccc/resource/technical/document/datasheet/0e/0c/26/c9/a4/d4/4b/a1/DM00236470.pdf/files/DM00236470.pdf/jcr:content/translations/en.DM00236470.pdf; ComponentLink1Description: http://www.st.com/content/ccc/resource/technical/document/datasheet/0e/0c/26/c9/a4/d4/4b/a1/DM00236470.pdf/files/DM00236470.pdf/jcr:content/translations/en.DM00236470.pdf; Supplier 1: Mouser; Supplier Part Number 1: 511-LDK320M33R; Supplier 2: Farnell; Supplier Part Number 2: 3130011; Supplier 3: Digi-Key; Supplier Part Number 3: 497-17034-1-ND
U4 = LM27761DSGT: Low-Noise Regulated Inverter with Integrated LDO 8-WSON -40 to 85; Manufacturer: Texas Instruments; Max Supply Voltage: 5.5V; Min Supply Voltage: 2.7V; Nominal Supply Current: 370uA; Supplier 1: Mouser; Supplier Part Number 1: 595-LM27761DSGT; Manufacturer Part Number: LM27761DSGT; RoHS: Yes; Category: Voltage Regulators - Switching; Stock 1: 2552; Pricing 1: 1=1.25, 10=0.81, 50=0.81, 100=0.72, 1000=0.72, 10000=0.72 (USD); Length: 2mm; Width: 2mm; Height: 800um; Thickness: 750um; ComponentLink1URL: http://www.ti.com/lit/gpn/lm27761?src-supplier=Mouser; ComponentLink1Description: http://www.ti.com/lit/gpn/lm27761?src-supplier=Mouser; ComponentLink2URL: http://www.ti.com/general/docs/lit/getliterature.tsp?genericPartNumber=LM27761&amp;&amp;fileType=pdf&src-supplier=Newark; ComponentLink2Description: http://www.ti.com/general/docs/lit/getliterature.tsp?genericPartNumber=LM27761&amp;&amp;fileType=pdf&src-supplier=Newark; ComponentLink3URL: http://www.ti.com/general/docs/lit/getliterature.tsp?genericPartNumber=LM27761&amp;&amp;fileType=pdf&src-supplier=Farnell; ComponentLink3Description: http://www.ti.com/general/docs/lit/getliterature.tsp?genericPartNumber=LM27761&amp;&amp;fileType=pdf&src-supplier=Farnell; ComponentLink4URL: http://www.ti.com/general/docs/lit/getliterature.tsp?genericPartNumber=LM27761&&fileType=pdf&src-supplier=Farnell; ComponentLink4Description: http://www.ti.com/general/docs/lit/getliterature.tsp?genericPartNumber=LM27761&&fileType=pdf&src-supplier=Farnell; ComponentLink5URL: http://www.ti.com/general/docs/suppproductinfo.tsp?distId=10&amp;gotoUrl=http%3A%2F%2Fwww.ti.com%2Flit%2Fgpn%2Flm27761&src-supplier=Digikey; ComponentLink5Description: http://www.ti.com/general/docs/suppproductinfo.tsp?distId=10&amp;gotoUrl=http%3A%2F%2Fwww.ti.com%2Flit%2Fgpn%2Flm27761&src-supplier=Digikey; ComponentLink6URL: http://www.ti.com/lit/ds/symlink/lm27761.pdf?src-supplier=Digikey; ComponentLink6Description: http://www.ti.com/lit/ds/symlink/lm27761.pdf?src-supplier=Digikey; ComponentLink7URL: http://www.ti.com/general/docs/lit/getliterature.tsp?genericPartNumber=LM27761&&fileType=pdf&src-supplier=Element14; ComponentLink7Description: http://www.ti.com/general/docs/lit/getliterature.tsp?genericPartNumber=LM27761&&fileType=pdf&src-supplier=Element14; Supplier 2: Texas Instruments; Supplier Part Number 2: LM27761DSGT; Supplier 3: Digikey; Supplier Part Number 3: 296-43882-1-ND